# Altium project GECKO3.PRJPCB (part 1 of 4)
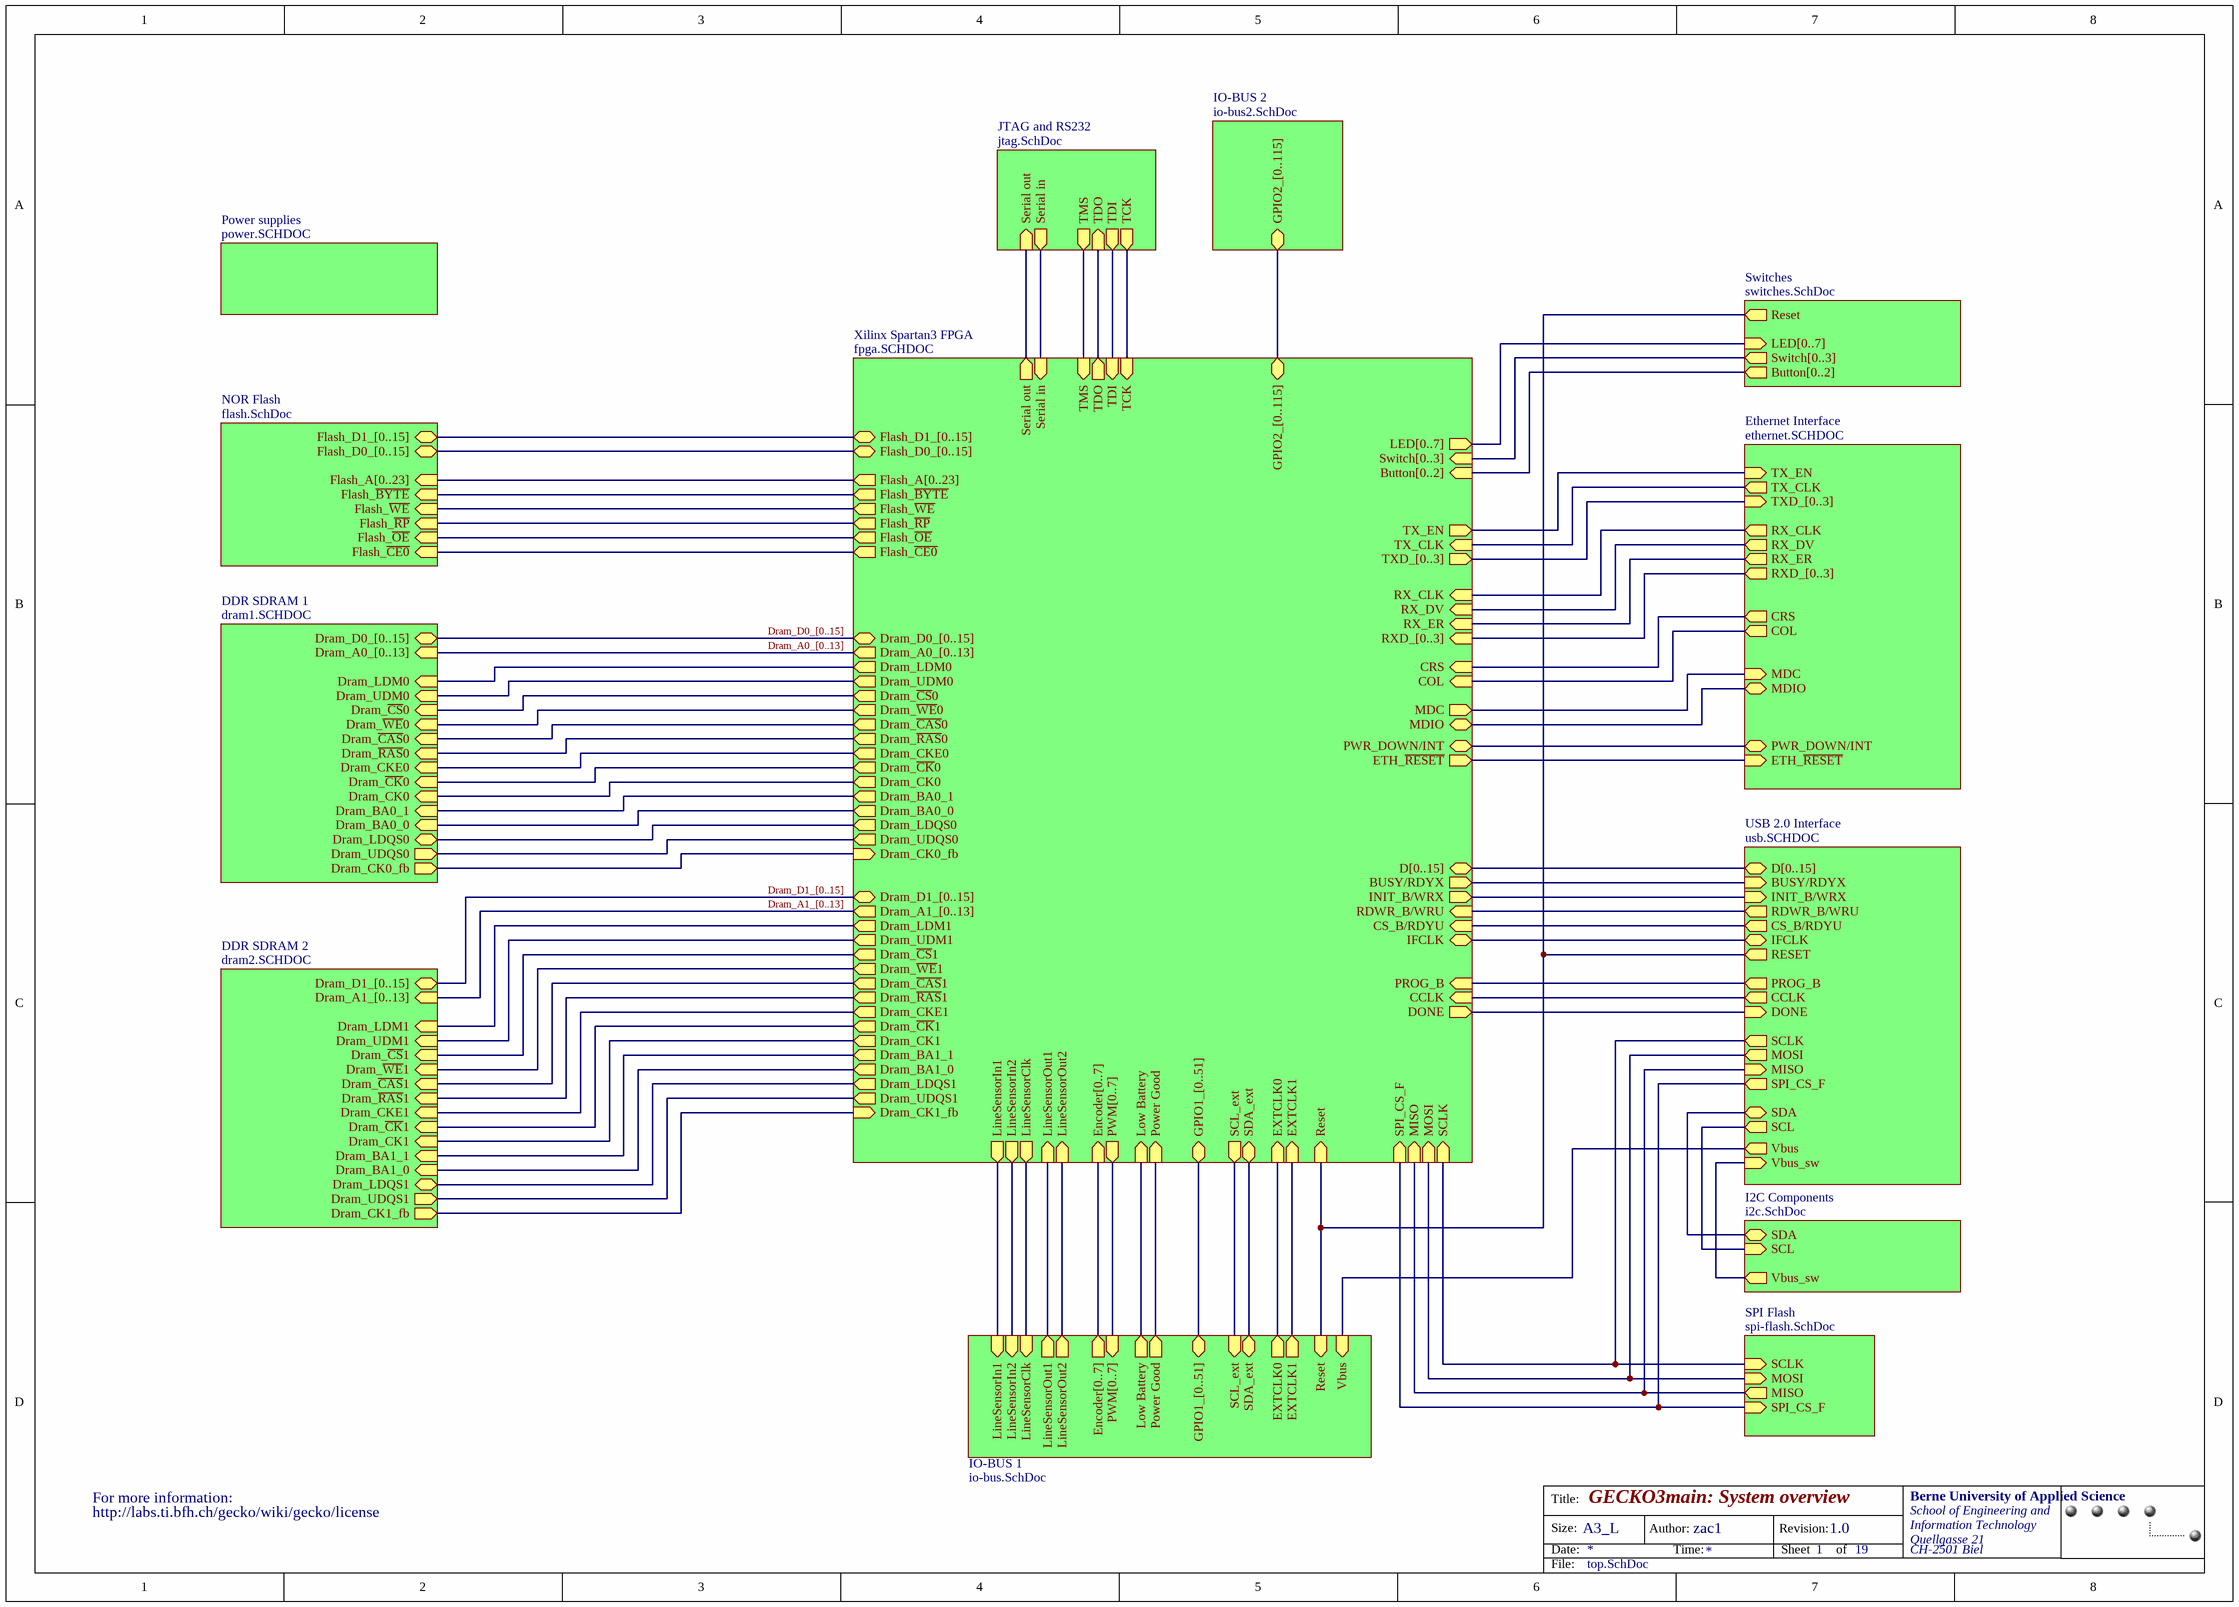
[diagram p0: top.SchDoc]
.SHEETTOTAL: 19; .TITLE: Gecko3
17 sheets, 291 parts. Net scope: global (net labels, ports and power ports of the same name join across sheets).
Board files: gecko3.PcbDoc, gecko3_Panel.pcbdoc, amp.PcbDoc, gecko3_stencil.PCBDOC
Sheets:
  top.SchDoc
    Power supplies = power.SCHDOC
    Xilinx Spartan3 FPGA = fpga.SCHDOC
      fpga-config = fpga-config.SCHDOC
      U_fpga1 = fpga1.SchDoc
      U_fpga2 = fpga2.SCHDOC
    SPI Flash = spi-flash.SchDoc
    Ethernet Interface = ethernet.SCHDOC
    JTAG and RS232 = jtag.SchDoc
    I2C Components = i2c.SchDoc
    IO-BUS 1 = io-bus.SchDoc
    IO-BUS 2 = io-bus2.SchDoc
    Switches = switches.SchDoc
    USB 2.0 Interface = usb.SCHDOC
    NOR Flash = flash.SchDoc
    DDR SDRAM 1 = dram1.SCHDOC
    DDR SDRAM 2 = dram2.SCHDOC

## Sheet top.SchDoc: GECKO3main: System overview
size A3; Organization: Berne University of Applied Science; Address1: School of Engineering and; Address2: Information Technology; Address3: Quellgasse 21; Address4: CH-2501 Biel; Revision: 1.0; SheetNumber: 1; SheetTotal: 19; ApprovedBy: zem1; Author: zac1

### Parts
1  (no value)  [CC-License]

### Sub-sheets
DDR SDRAM 1 = dram1.SCHDOC: Dram_D0_[0..15] (bidir), Dram_A0_[0..13] (in), Dram_LDM0 (in), Dram_UDM0 (in), Dram_~{CS}0 (in), Dram_~{WE}0 (in), Dram_~{CAS}0 (in), Dram_~{RAS}0 (in), Dram_CKE0 (in), Dram_~{CK}0 (in), Dram_CK0 (in), Dram_BA0_1 (in), Dram_BA0_0 (in), Dram_LDQS0 (bidir), Dram_UDQS0 (out), Dram_CK0_fb (out)
DDR SDRAM 2 = dram2.SCHDOC: Dram_D1_[0..15] (bidir), Dram_A1_[0..13] (in), Dram_LDM1 (in), Dram_UDM1 (in), Dram_~{CS}1 (in), Dram_~{WE}1 (in), Dram_~{CAS}1 (in), Dram_~{RAS}1 (in), Dram_CKE1 (in), Dram_~{CK}1 (in), Dram_CK1 (in), Dram_BA1_1 (in), Dram_BA1_0 (in), Dram_LDQS1 (bidir), Dram_UDQS1 (out), Dram_CK1_fb (out)
Ethernet Interface = ethernet.SCHDOC: PWR_DOWN/INT (bidir), ETH_~{RESET} (in), TX_CLK (out), RXD_[0..3] (out), RX_CLK (out), RX_DV (out), RX_ER (out), CRS (out), COL (out), TX_EN (in), TXD_[0..3] (in), MDC (in), MDIO (bidir)
I2C Components = i2c.SchDoc: SDA (bidir), SCL (in), Vbus_sw (out)
IO-BUS 1 = io-bus.SchDoc: Vbus (in), PWM[0..7] (in), GPIO1_[0..51] (bidir), Encoder[0..7] (out), Power Good (out), Low Battery (out), SDA_ext (bidir), Reset (in), SCL_ext (in), EXTCLK0 (out), EXTCLK1 (out), LineSensorOut2 (out), LineSensorOut1 (out), LineSensorIn2 (in), LineSensorClk (in), LineSensorIn1 (in)
IO-BUS 2 = io-bus2.SchDoc: GPIO2_[0..115] (bidir)
JTAG and RS232 = jtag.SchDoc: TCK (out), TDI (out), TMS (out), TDO (in), Serial out (in), Serial in (out)
NOR Flash = flash.SchDoc: Flash_A[0..23] (in), Flash_~{BYTE} (in), Flash_~{WE} (in), Flash_~{RP} (in), Flash_~{OE} (in), Flash_~{CE0} (in), Flash_D0_[0..15] (bidir), Flash_D1_[0..15] (bidir)
Power supplies = power.SCHDOC: no entries
SPI Flash = spi-flash.SchDoc: MOSI (in), SPI_CS_F (in), SCLK (in), MISO (out)
Switches = switches.SchDoc: LED[0..7] (in), Button[0..2] (out), Switch[0..3] (out), Reset (out)
USB 2.0 Interface = usb.SCHDOC: D[0..15] (bidir), Vbus (out), DONE (in), INIT_B/WRX (in), PROG_B (out), RDWR_B/WRU (out), BUSY/RDYX (in), RESET (out), CS_B/RDYU (out), CCLK (out), MISO (in), SPI_CS_F (out), MOSI (out), SCLK (out), SDA (bidir), SCL (out), Vbus_sw (in), IFCLK (bidir)
Xilinx Spartan3 FPGA = fpga.SCHDOC: PWR_DOWN/INT (bidir), ETH_~{RESET} (out), Flash_D1_[0..15] (bidir), Power Good (in), Low Battery (in), Flash_D0_[0..15] (bidir), Flash_~{BYTE} (out), Flash_~{WE} (out), Flash_~{RP} (out), Flash_~{OE} (out), Flash_~{CE0} (out), SDA_ext (bidir), SCL_ext (out), PWM[0..7] (out), GPIO1_[0..51] (bidir), Encoder[0..7] (in), GPIO2_[0..115] (bidir), Flash_A[0..23] (out), MOSI (in), SCLK (in), MISO (in), SPI_CS_F (in), Dram_D1_[0..15] (bidir), Dram_A1_[0..13] (out), Dram_LDM1 (out), Dram_UDM1 (out), Dram_~{CS}1 (out), Dram_~{WE}1 (out), Dram_~{CAS}1 (out), Dram_~{RAS}1 (out), Dram_CKE1 (out), Dram_~{CK}1 (out), Dram_CK1 (out), Dram_BA1_1 (out), Dram_BA1_0 (out), Dram_LDQS1 (out), Dram_UDQS1 (out), LED[0..7] (out), Button[0..2] (in), Switch[0..3] (in), TX_CLK (in), RXD_[0..3] (in), RX_CLK (in), RX_DV (in), RX_ER (in), CRS (in), COL (in), TX_EN (out), TXD_[0..3] (out), MDC (out), MDIO (bidir), D[0..15] (bidir), DONE (out), INIT_B/WRX (out), PROG_B (in), RDWR_B/WRU (in), BUSY/RDYX (out), CS_B/RDYU (in), CCLK (in), Dram_D0_[0..15] (bidir), Dram_A0_[0..13] (out), Dram_LDM0 (out), Dram_UDM0 (out), Dram_~{CS}0 (out), Dram_~{WE}0 (out), Dram_~{CAS}0 (out), Dram_~{RAS}0 (out), Dram_CKE0 (out), Dram_~{CK}0 (out), Dram_CK0 (out), Dram_BA0_1 (out), Dram_BA0_0 (out), Dram_LDQS0 (out), Dram_UDQS0 (out), EXTCLK0 (in), EXTCLK1 (in), TCK (in), TDI (in), TMS (in), TDO (out), Serial out (out), Serial in (in), Reset (in), IFCLK (bidir), Dram_CK1_fb (in), Dram_CK0_fb (in), LineSensorOut2 (in), LineSensorOut1 (in), LineSensorIn2 (out), LineSensorClk (out), LineSensorIn1 (out)

### Nets
(unnamed): sheet Xilinx Spartan3 FPGA/PWR_DOWN/INT, sheet Ethernet Interface/PWR_DOWN/INT
(unnamed): sheet Xilinx Spartan3 FPGA/ETH_~{RESET}, sheet Ethernet Interface/ETH_~{RESET}
(unnamed): sheet Xilinx Spartan3 FPGA/Power Good, sheet IO-BUS 1/Power Good
(unnamed): sheet Xilinx Spartan3 FPGA/Low Battery, sheet IO-BUS 1/Low Battery
(unnamed): sheet Xilinx Spartan3 FPGA/Flash_~{BYTE}, sheet NOR Flash/Flash_~{BYTE}
(unnamed): sheet Xilinx Spartan3 FPGA/Flash_~{WE}, sheet NOR Flash/Flash_~{WE}
(unnamed): sheet Xilinx Spartan3 FPGA/Flash_~{RP}, sheet NOR Flash/Flash_~{RP}
(unnamed): sheet Xilinx Spartan3 FPGA/Flash_~{OE}, sheet NOR Flash/Flash_~{OE}
(unnamed): sheet Xilinx Spartan3 FPGA/Flash_~{CE0}, sheet NOR Flash/Flash_~{CE0}
(unnamed): sheet Xilinx Spartan3 FPGA/SDA_ext, sheet IO-BUS 1/SDA_ext
(unnamed): sheet Xilinx Spartan3 FPGA/SCL_ext, sheet IO-BUS 1/SCL_ext
(unnamed): sheet Xilinx Spartan3 FPGA/MOSI, sheet SPI Flash/MOSI, sheet USB 2.0 Interface/MOSI
(unnamed): sheet Xilinx Spartan3 FPGA/SCLK, sheet SPI Flash/SCLK, sheet USB 2.0 Interface/SCLK
(unnamed): sheet Xilinx Spartan3 FPGA/MISO, sheet SPI Flash/MISO, sheet USB 2.0 Interface/MISO
(unnamed): sheet Xilinx Spartan3 FPGA/SPI_CS_F, sheet SPI Flash/SPI_CS_F, sheet USB 2.0 Interface/SPI_CS_F
(unnamed): sheet Xilinx Spartan3 FPGA/Dram_LDM1, sheet DDR SDRAM 2/Dram_LDM1
(unnamed): sheet Xilinx Spartan3 FPGA/Dram_UDM1, sheet DDR SDRAM 2/Dram_UDM1
(unnamed): sheet Xilinx Spartan3 FPGA/Dram_~{CS}1, sheet DDR SDRAM 2/Dram_~{CS}1
(unnamed): sheet Xilinx Spartan3 FPGA/Dram_~{WE}1, sheet DDR SDRAM 2/Dram_~{WE}1
(unnamed): sheet Xilinx Spartan3 FPGA/Dram_~{CAS}1, sheet DDR SDRAM 2/Dram_~{CAS}1
(unnamed): sheet Xilinx Spartan3 FPGA/Dram_~{RAS}1, sheet DDR SDRAM 2/Dram_~{RAS}1
(unnamed): sheet Xilinx Spartan3 FPGA/Dram_CKE1, sheet DDR SDRAM 2/Dram_CKE1
(unnamed): sheet Xilinx Spartan3 FPGA/Dram_~{CK}1, sheet DDR SDRAM 2/Dram_~{CK}1
(unnamed): sheet Xilinx Spartan3 FPGA/Dram_CK1, sheet DDR SDRAM 2/Dram_CK1
(unnamed): sheet Xilinx Spartan3 FPGA/Dram_BA1_1, sheet DDR SDRAM 2/Dram_BA1_1
(unnamed): sheet Xilinx Spartan3 FPGA/Dram_BA1_0, sheet DDR SDRAM 2/Dram_BA1_0
(unnamed): sheet Xilinx Spartan3 FPGA/Dram_LDQS1, sheet DDR SDRAM 2/Dram_LDQS1
(unnamed): sheet Xilinx Spartan3 FPGA/Dram_UDQS1, sheet DDR SDRAM 2/Dram_UDQS1
(unnamed): sheet Xilinx Spartan3 FPGA/TX_CLK, sheet Ethernet Interface/TX_CLK
(unnamed): sheet Xilinx Spartan3 FPGA/RX_CLK, sheet Ethernet Interface/RX_CLK
(unnamed): sheet Xilinx Spartan3 FPGA/RX_DV, sheet Ethernet Interface/RX_DV
(unnamed): sheet Xilinx Spartan3 FPGA/RX_ER, sheet Ethernet Interface/RX_ER
(unnamed): sheet Xilinx Spartan3 FPGA/CRS, sheet Ethernet Interface/CRS
(unnamed): sheet Xilinx Spartan3 FPGA/COL, sheet Ethernet Interface/COL
(unnamed): sheet Xilinx Spartan3 FPGA/TX_EN, sheet Ethernet Interface/TX_EN
(unnamed): sheet Xilinx Spartan3 FPGA/MDC, sheet Ethernet Interface/MDC
(unnamed): sheet Xilinx Spartan3 FPGA/MDIO, sheet Ethernet Interface/MDIO
(unnamed): sheet Xilinx Spartan3 FPGA/DONE, sheet USB 2.0 Interface/DONE
(unnamed): sheet Xilinx Spartan3 FPGA/INIT_B/WRX, sheet USB 2.0 Interface/INIT_B/WRX
(unnamed): sheet Xilinx Spartan3 FPGA/PROG_B, sheet USB 2.0 Interface/PROG_B
(unnamed): sheet Xilinx Spartan3 FPGA/RDWR_B/WRU, sheet USB 2.0 Interface/RDWR_B/WRU
(unnamed): sheet Xilinx Spartan3 FPGA/BUSY/RDYX, sheet USB 2.0 Interface/BUSY/RDYX
(unnamed): sheet Xilinx Spartan3 FPGA/CS_B/RDYU, sheet USB 2.0 Interface/CS_B/RDYU
(unnamed): sheet Xilinx Spartan3 FPGA/CCLK, sheet USB 2.0 Interface/CCLK
(unnamed): sheet Xilinx Spartan3 FPGA/Dram_LDM0, sheet DDR SDRAM 1/Dram_LDM0
(unnamed): sheet Xilinx Spartan3 FPGA/Dram_UDM0, sheet DDR SDRAM 1/Dram_UDM0
(unnamed): sheet Xilinx Spartan3 FPGA/Dram_~{CS}0, sheet DDR SDRAM 1/Dram_~{CS}0
(unnamed): sheet Xilinx Spartan3 FPGA/Dram_~{WE}0, sheet DDR SDRAM 1/Dram_~{WE}0
(unnamed): sheet Xilinx Spartan3 FPGA/Dram_~{CAS}0, sheet DDR SDRAM 1/Dram_~{CAS}0
(unnamed): sheet Xilinx Spartan3 FPGA/Dram_~{RAS}0, sheet DDR SDRAM 1/Dram_~{RAS}0
(unnamed): sheet Xilinx Spartan3 FPGA/Dram_CKE0, sheet DDR SDRAM 1/Dram_CKE0
(unnamed): sheet Xilinx Spartan3 FPGA/Dram_~{CK}0, sheet DDR SDRAM 1/Dram_~{CK}0
(unnamed): sheet Xilinx Spartan3 FPGA/Dram_CK0, sheet DDR SDRAM 1/Dram_CK0
(unnamed): sheet Xilinx Spartan3 FPGA/Dram_BA0_1, sheet DDR SDRAM 1/Dram_BA0_1
(unnamed): sheet Xilinx Spartan3 FPGA/Dram_BA0_0, sheet DDR SDRAM 1/Dram_BA0_0
(unnamed): sheet Xilinx Spartan3 FPGA/Dram_LDQS0, sheet DDR SDRAM 1/Dram_LDQS0
(unnamed): sheet Xilinx Spartan3 FPGA/Dram_UDQS0, sheet DDR SDRAM 1/Dram_UDQS0
(unnamed): sheet Xilinx Spartan3 FPGA/EXTCLK0, sheet IO-BUS 1/EXTCLK0
(unnamed): sheet Xilinx Spartan3 FPGA/EXTCLK1, sheet IO-BUS 1/EXTCLK1
(unnamed): sheet Xilinx Spartan3 FPGA/TCK, sheet JTAG and RS232/TCK
(unnamed): sheet Xilinx Spartan3 FPGA/TDI, sheet JTAG and RS232/TDI
(unnamed): sheet Xilinx Spartan3 FPGA/TMS, sheet JTAG and RS232/TMS
(unnamed): sheet Xilinx Spartan3 FPGA/TDO, sheet JTAG and RS232/TDO
(unnamed): sheet Xilinx Spartan3 FPGA/Serial out, sheet JTAG and RS232/Serial out
(unnamed): sheet Xilinx Spartan3 FPGA/Serial in, sheet JTAG and RS232/Serial in
(unnamed): sheet Xilinx Spartan3 FPGA/Reset, sheet IO-BUS 1/Reset, sheet Switches/Reset, sheet USB 2.0 Interface/RESET
(unnamed): sheet Xilinx Spartan3 FPGA/IFCLK, sheet USB 2.0 Interface/IFCLK
(unnamed): sheet Xilinx Spartan3 FPGA/Dram_CK1_fb, sheet DDR SDRAM 2/Dram_CK1_fb
(unnamed): sheet Xilinx Spartan3 FPGA/Dram_CK0_fb, sheet DDR SDRAM 1/Dram_CK0_fb
(unnamed): sheet Xilinx Spartan3 FPGA/LineSensorOut2, sheet IO-BUS 1/LineSensorOut2
(unnamed): sheet Xilinx Spartan3 FPGA/LineSensorOut1, sheet IO-BUS 1/LineSensorOut1
(unnamed): sheet Xilinx Spartan3 FPGA/LineSensorIn2, sheet IO-BUS 1/LineSensorIn2
(unnamed): sheet Xilinx Spartan3 FPGA/LineSensorClk, sheet IO-BUS 1/LineSensorClk
(unnamed): sheet Xilinx Spartan3 FPGA/LineSensorIn1, sheet IO-BUS 1/LineSensorIn1
(unnamed): sheet I2C Components/SDA, sheet USB 2.0 Interface/SDA
(unnamed): sheet I2C Components/SCL, sheet USB 2.0 Interface/SCL
(unnamed): sheet I2C Components/Vbus_sw, sheet USB 2.0 Interface/Vbus_sw
(unnamed): sheet IO-BUS 1/Vbus, sheet USB 2.0 Interface/Vbus

### Buses and harness runs
bus Dram_A0_[0..13] = sheet DDR SDRAM 1/Dram_A0_[0..13] = sheet Xilinx Spartan3 FPGA/Dram_A0_[0..13]
bus Dram_A1_[0..13] = sheet DDR SDRAM 2/Dram_A1_[0..13] = sheet Xilinx Spartan3 FPGA/Dram_A1_[0..13]
bus Dram_D0_[0..15] = sheet DDR SDRAM 1/Dram_D0_[0..15] = sheet Xilinx Spartan3 FPGA/Dram_D0_[0..15]
bus Dram_D1_[0..15] = sheet DDR SDRAM 2/Dram_D1_[0..15] = sheet Xilinx Spartan3 FPGA/Dram_D1_[0..15]
bus sheet Ethernet Interface/RXD_[0..3] = sheet Xilinx Spartan3 FPGA/RXD_[0..3]
bus sheet Ethernet Interface/TXD_[0..3] = sheet Xilinx Spartan3 FPGA/TXD_[0..3]
bus sheet IO-BUS 1/Encoder[0..7] = sheet Xilinx Spartan3 FPGA/Encoder[0..7]
bus sheet IO-BUS 1/GPIO1_[0..51] = sheet Xilinx Spartan3 FPGA/GPIO1_[0..51]
bus sheet IO-BUS 1/PWM[0..7] = sheet Xilinx Spartan3 FPGA/PWM[0..7]
bus sheet IO-BUS 2/GPIO2_[0..115] = sheet Xilinx Spartan3 FPGA/GPIO2_[0..115]
bus sheet NOR Flash/Flash_A[0..23] = sheet Xilinx Spartan3 FPGA/Flash_A[0..23]
bus sheet NOR Flash/Flash_D0_[0..15] = sheet Xilinx Spartan3 FPGA/Flash_D0_[0..15]
bus sheet NOR Flash/Flash_D1_[0..15] = sheet Xilinx Spartan3 FPGA/Flash_D1_[0..15]
bus sheet Switches/Button[0..2] = sheet Xilinx Spartan3 FPGA/Button[0..2]
bus sheet Switches/LED[0..7] = sheet Xilinx Spartan3 FPGA/LED[0..7]
bus sheet Switches/Switch[0..3] = sheet Xilinx Spartan3 FPGA/Switch[0..3]
bus sheet USB 2.0 Interface/D[0..15] = sheet Xilinx Spartan3 FPGA/D[0..15]

### Notes on the sheet
- (near 1) http://labs.ti.bfh.ch/gecko/wiki/gecko/license
- (near 1) For more information:
- Title:
- Size:
- Date:
- A3_L
- Author:
- Time:
- Revision:
- Sheet
- of
- File:

### Library data of the parts
1 = CC License

## Sheet power.SCHDOC: Power Suplies
size A4; Organization: Berne University of Applied Science; Address1: School of Engineering and; Address2: Information Technology; Address3: Quellgasse 21; Address4: CH-2501 Biel; Revision: 1.0; SheetNumber: 6; SheetTotal: 19; ApprovedBy: zem1; Author: zac1
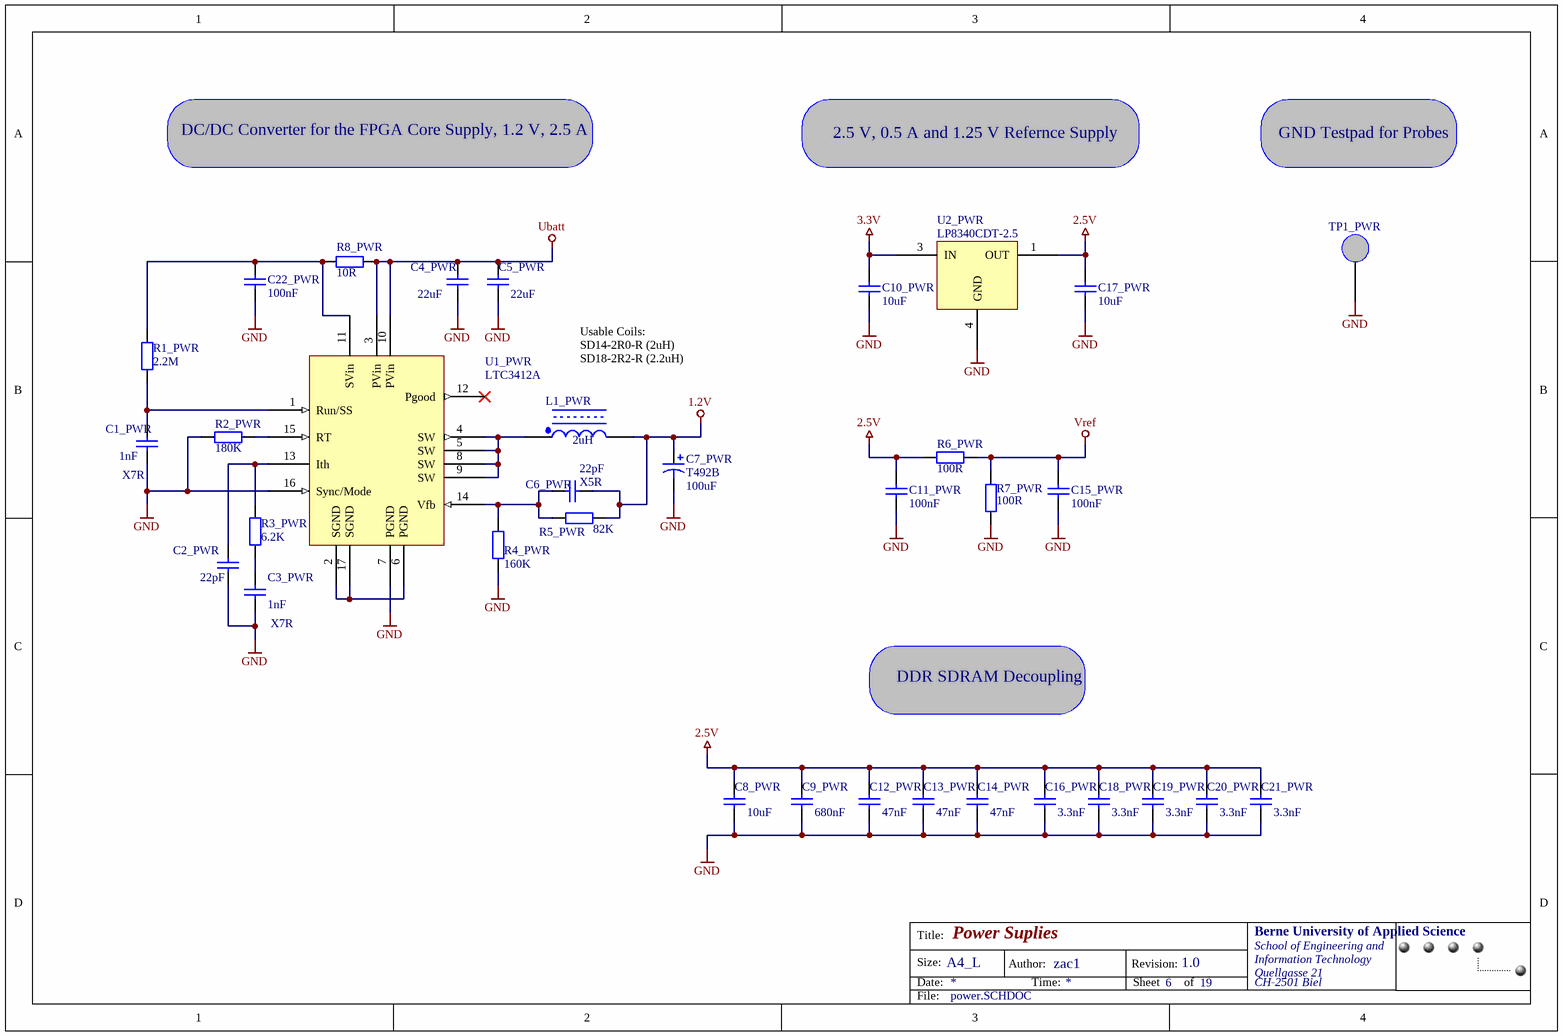
[diagram p1: power.SCHDOC]

### Parts
C1_PWR  value 1nF  Spec: X7R  [0402]  (hidden comment: Cap)
C2_PWR  value 22pF  [0402]  (hidden comment: Cap)
C3_PWR  value 1nF  Spec: X7R  [0402]  (hidden comment: Cap)
C4_PWR  value 22uF  [CC3225-1210]  (hidden comment: Cap)
C5_PWR  value 22uF  [1210]  (hidden comment: Cap)
C6_PWR  value 22pF  Spec: X5R  [0402]  (hidden comment: Cap)
C7_PWR  T492B  value 100uF  [B]
C8_PWR  value 10uF  [1206]  (hidden comment: Cap)
C9_PWR  value 680nF  [0805]  (hidden comment: Cap)
C10_PWR  value 10uF  [1206]  (hidden comment: Cap)
C11_PWR  value 100nF  [0402]  (hidden comment: Cap)
C12_PWR  value 47nF  [0402]  (hidden comment: Cap)
C13_PWR  value 47nF  [0402]  (hidden comment: Cap)
C14_PWR  value 47nF  [0402]  (hidden comment: Cap)
C15_PWR  value 100nF  [0402]  (hidden comment: Cap)
C16_PWR  value 3.3nF  [0402]  (hidden comment: Cap)
C17_PWR  value 10uF  [1206]  (hidden comment: Cap)
C18_PWR  value 3.3nF  [0402]  (hidden comment: Cap)
C19_PWR  value 3.3nF  [0402]  (hidden comment: Cap)
C20_PWR  value 3.3nF  [0402]  (hidden comment: Cap)
C21_PWR  value 3.3nF  [0402]  (hidden comment: Cap)
C22_PWR  value 100nF  [0402]  (hidden comment: Cap)
L1_PWR  2uH  [coil-sd-serie]
R1_PWR  value 2.2M  [0402]  (hidden comment: Res2)
R2_PWR  value 180K  [0402]  (hidden comment: Res2)
R3_PWR  value 6.2K  [0603]  (hidden comment: Res2)
R4_PWR  value 160K  [0603]  (hidden comment: Res2)
R5_PWR  value 82K  [0402]  (hidden comment: Res2)
R6_PWR  value 100R  [0402]  (hidden comment: Res2)
R7_PWR  value 100R  [0402]  (hidden comment: Res2)
R8_PWR  value 10R  [0402]  (hidden comment: Res2)
TP1_PWR  TESTPAD-SMD  [TESTPAD-SMD]  (value not drawn)
U1_PWR  LTC3412A  [QFN16]
U2_PWR  value LP8340CDT-2.5  [TO-252]  (hidden comment: LP8340CDT)

### Nets
1.2V: C6_PWR.1 C7_PWR.1 L1_PWR.2 R5_PWR.1
2.5V: C8_PWR.1 C9_PWR.1 C11_PWR.2 C12_PWR.1 C13_PWR.1 C14_PWR.1 C16_PWR.1 C17_PWR.2 C18_PWR.1 C19_PWR.1 C20_PWR.1 C21_PWR.1 R6_PWR.2 U2_PWR.1(OUT)
3.3V: C10_PWR.2 U2_PWR.3(IN)
GND: C1_PWR.1 C2_PWR.1 C3_PWR.1 C4_PWR.1 C5_PWR.1 C7_PWR.2 C8_PWR.2 C9_PWR.2 C10_PWR.1 C11_PWR.1 C12_PWR.2 C13_PWR.2 C14_PWR.2 C15_PWR.1 C16_PWR.2 C17_PWR.1 C18_PWR.2 C19_PWR.2 C20_PWR.2 C21_PWR.2 C22_PWR.2 R2_PWR.2 R4_PWR.1 R7_PWR.1 TP1_PWR.1 U1_PWR.7(PGND) U1_PWR.16(Sync/Mode) U2_PWR.4(GND)
Ubatt: C4_PWR.2 C5_PWR.2 R8_PWR.1 U1_PWR.3(PVin) U1_PWR.10(PVin)
Vref: C15_PWR.2 R6_PWR.1 R7_PWR.2
NetC1_PWR_2: C1_PWR.2 R1_PWR.1 U1_PWR.1(Run/SS)
NetC2_PWR_2: C2_PWR.2 R3_PWR.1 U1_PWR.13(Ith)
NetC3_PWR_2: C3_PWR.2 R3_PWR.2
NetC6_PWR_2: C6_PWR.2 R4_PWR.2 R5_PWR.2 U1_PWR.14(Vfb)
NetC22_PWR_1: C22_PWR.1 R1_PWR.2 R8_PWR.2 U1_PWR.11(SVin)
NetL1_PWR_1: L1_PWR.1 U1_PWR.4(SW) U1_PWR.5(SW) U1_PWR.8(SW) U1_PWR.9(SW)
NetR2_PWR_1: R2_PWR.1 U1_PWR.15(RT)
NetU1_PWR_2: U1_PWR.2(SGND) U1_PWR.6(PGND) U1_PWR.17(SGND)

Not connected (* = marked no-connect by the designer): U1_PWR 12(Pgood)*

### Notes on the sheet
- DC/DC Converter for the FPGA Core Supply, 1.2 V, 2.5 A
- 2.5 V, 0.5 A and 1.25 V Refernce Supply
- GND Testpad for Probes
- Usable Coils:
  SD14-2R0-R (2uH)
  SD18-2R2-R (2.2uH)
- DDR SDRAM Decoupling
- Title:
- Size:
- Date:
- A4_L
- Author:
- Time:
- Revision:
- Sheet
- of
- File:

### Library data of the parts
C1_PWR C3_PWR = Cap: Capacitor; Manufacturer: PHYCOMP; Part Number: 2238 587 15623; Class I: Passive; Currency: CHF; Packaging unit: 10; Prize: 0.11; Published: 8-Jun-2000; Revision: July-2002: Re-released for DXP Platform.; Publisher: Altium Limited; Class II: Capacitor; Distributor Number: 3019 380; RoHS: yes; Distributor: Farnell
C2_PWR C6_PWR = Cap: Capacitor; Manufacturer: Murata; Part Number: GRM1555C1H220JZ01D; Class I: Passive; Currency: CHF; Packaging unit: 10; Prize: 0.07; Published: 8-Jun-2000; Revision: July-2002: Re-released for DXP Platform.; Publisher: Altium Limited; Class II: Capacitor; Distributor Number: 8819 629; RoHS: yes; Distributor: Farnell
C4_PWR C5_PWR = Cap: Capacitor; Manufacturer: Yuden; Part Number: EMK325BJ226MM-T; Class I: Passive; Currency: CHF; Packaging unit: 1; Prize: 0.67; lead time: 14 Tage; Published: 8-Jun-2000; Revision: July-2002: Re-released for DXP Platform.; Publisher: Altium Limited; Class II: Capacitor; Distributor Number: 6578 950; RoHS: yes; Distributor: Farnell
C7_PWR = T492B: Solid Tantalum Chip Capacitor, T492 Series - CWR11 Style Per Mil-PRF-55365/8; Manufacturer: AVX; Part Number: TCJB107M004R0070; Currency: CHF; Packaging unit: 1; Prize: 0.98; Published: 17-Jul-2002; LatestRevisionDate: 19-Mar-2004; LatestRevisionNote: Silkscreen dimensions re-sized.; DatasheetDocument: Mar-2001; PackageDocument: Mar-2001; PackageReference: B; Publisher: Altium Limited; Code_JEITA: 3528-21; ComponentLink1Description: Manufacturer Link; ComponentLink1URL: http://www.kemet.com/; ComponentLink2Description: Datasheet; ComponentLink2URL: http://www.kemet.com/kemet/web/homepage/kechome.nsf/vapubfilesname/F3102TA.pdf/$file/F3102TA.pdf; Distributor Number: 1135 228; RoHS: yes; Distributor: Farnell
C8_PWR C10_PWR C17_PWR = Cap: Capacitor; Manufacturer: Murata; Part Number: GRM31CR70J106KA01L; Class I: Passive; Currency: CHF; Packaging unit: 1; Prize: 0.25; Published: 8-Jun-2000; Revision: July-2002: Re-released for DXP Platform.; Publisher: Altium Limited; Class II: Capacitor; Distributor Number: 9527 729; RoHS: yes; Distributor: Farnell
C9_PWR = Cap: Capacitor; Manufacturer: PHYCOMP; Part Number: 2238 240 15661; Class I: Passive; Currency: CHF; Packaging unit: 10; Prize: 0.34; Published: 8-Jun-2000; Revision: July-2002: Re-released for DXP Platform.; Publisher: Altium Limited; Class II: Capacitor; Distributor Number: 3352 055; RoHS: yes; Distributor: Farnell
C11_PWR C15_PWR C22_PWR = Cap: Capacitor; Manufacturer: Murata; Part Number: GRM155R71C104KA88D; Class I: Passive; Currency: CHF; Packaging unit: 10; Prize: 0.07; Published: 8-Jun-2000; Revision: July-2002: Re-released for DXP Platform.; Publisher: Altium Limited; Class II: Capacitor; Distributor Number: 8819 742; RoHS: yes; Distributor: Farnell
C12_PWR C13_PWR C14_PWR = Cap: Capacitor; Manufacturer: PHYCOMP; Part Number: 2238 787 19845; Class I: Passive; Currency: CHF; Packaging unit: 10; Prize: 0.15; Published: 8-Jun-2000; Revision: July-2002: Re-released for DXP Platform.; Publisher: Altium Limited; Class II: Capacitor; Distributor Number: 3019 469; RoHS: yes; Distributor: Farnell
C16_PWR C18_PWR C19_PWR C20_PWR C21_PWR = Cap: Capacitor; Manufacturer: PHYCOMP; Part Number: 2238 587 15629; Class I: Passive; Currency: CHF; Packaging unit: 10; Prize: 0.11; Published: 8-Jun-2000; Revision: July-2002: Re-released for DXP Platform.; Publisher: Altium Limited; Class II: Capacitor; Distributor Number: 3019 410; RoHS: yes; Distributor: Farnell
L1_PWR = COIL-SD-SERIE: SD Series Coils from Coiltronics; Manufacturer: Cooper Bussmann; Part Number: SD14-2R0-R; Currency: CHF; lead time: 10 Days; Packaging unit: 3800; Prize: 1.85; Value: 2uH; RoHS: yes; Distributor: Hy-Line
R1_PWR = Res2: Resistor; Manufacturer: PHYCOMP; Part Number: 232270672205; Class I: Passive; Currency: CHF; Packaging unit: 50; Prize: 0.12; Published: 8-Jun-2000; Revision: July-2002: Re-released for DXP Platform.; Publisher: Altium Limited; Class II: Resistor; Distributor Number: 9239618; RoHS: yes; Distributor: Farnell
R2_PWR = Res2: Resistor; Manufacturer: PHYCOMP; Part Number: 232270671804; Class I: Passive; Currency: CHF; Packaging unit: 50; Prize: 0.12; Published: 8-Jun-2000; Revision: July-2002: Re-released for DXP Platform.; Publisher: Altium Limited; Class II: Resistor; Distributor Number: 9239502; RoHS: yes; Distributor: Farnell
R3_PWR = Res2: Resistor; Manufacturer: Multicomp; Part Number: MC 0.063W 0603 1% 6K2; Class I: Passive; Currency: CHF; Packaging unit: 50; Prize: 0.055; Published: 8-Jun-2000; Revision: July-2002: Re-released for DXP Platform.; Publisher: Altium Limited; Class II: Resistor; Distributor Number: 9331409; RoHS: X-yes; Distributor: Farnell
R4_PWR = Res2: Resistor; Manufacturer: Multicomp; Part Number: MC 0.063W 0603 1% 160K; Class I: Passive; Currency: CHF; Packaging unit: 50; Prize: 0.055; Published: 8-Jun-2000; Revision: July-2002: Re-released for DXP Platform.; Publisher: Altium Limited; Class II: Resistor; Distributor Number: 9330682; RoHS: X-yes; Distributor: Farnell
R5_PWR = Res2: Resistor; Manufacturer: PHYCOMP; Part Number: 232270678203; Class I: Passive; Currency: CHF; Packaging unit: 50; Prize: 0.12; Published: 8-Jun-2000; Revision: July-2002: Re-released for DXP Platform.; Publisher: Altium Limited; Class II: Resistor; Distributor Number: 9239464; RoHS: yes; Distributor: Farnell
R6_PWR R7_PWR = Res2: Resistor; Manufacturer: PHYCOMP; Part Number: 232270671001; Class I: Passive; Currency: CHF; Packaging unit: 50; Prize: 0.12; Published: 8-Jun-2000; Revision: July-2002: Re-released for DXP Platform.; Publisher: Altium Limited; Class II: Resistor; Distributor Number: 9239111; RoHS: yes; Distributor: Farnell
R8_PWR = Res2: Resistor; Manufacturer: TYCO ELECTRONICS; Part Number: CRG0402J10R-10; Class I: Passive; Currency: CHF; Packaging unit: 50; Prize: 0.09; Published: 8-Jun-2000; Revision: July-2002: Re-released for DXP Platform.; Publisher: Altium Limited; Class II: Resistor; Distributor Number: 1174141; RoHS: yes; Distributor: Farnell
TP1_PWR = TESTPAD-SMD: Harwin SMD Testpad; Value: S1751-46R; Currency: CHF; Packaging unit: 100; Prize: 0.1895; Distributor Number: 1022 338; Manufacturer: HARWIN; Part Number: S1751-46R; RoHS: yes; Distributor: Farnell
U1_PWR = LTC3412A: 3 A, 4 MHz, Step-Down Regulator; Manufacturer: Linear; Part Number: LTC3412AEUF#PBF; Currency: $; Packaging unit: 1; Prize: 4.93; lead time: 2 Weeks; Value: LTC3412A; Distributor Number: LTC3412AEUF#PBF; RoHS: yes; Distributor: Linear online
U2_PWR = LP8340CDT: Low Dropout, Low IQ, 1.0A CMOS Linear Regulator; Manufacturer: National; Currency: CHF; Packaging unit: 75; Prize: 1.065; lead time: 6 Weeks; Part Number: LP8340CDT-2.5; RoHS: yes; Distributor: EBV; Distributor Number: LP8340CDT-2.5/NOPB

## Sheet fpga.SCHDOC: FPGA Parts
size A3; Organization: Berne University of Applied Science; Address1: School of Engineering and; Address2: Information Technology; Address3: Quellgasse 21; Address4: CH-2501 Biel; Revision: 1.0; SheetNumber: 2; SheetTotal: 19; ApprovedBy: zem1; Author: zac1
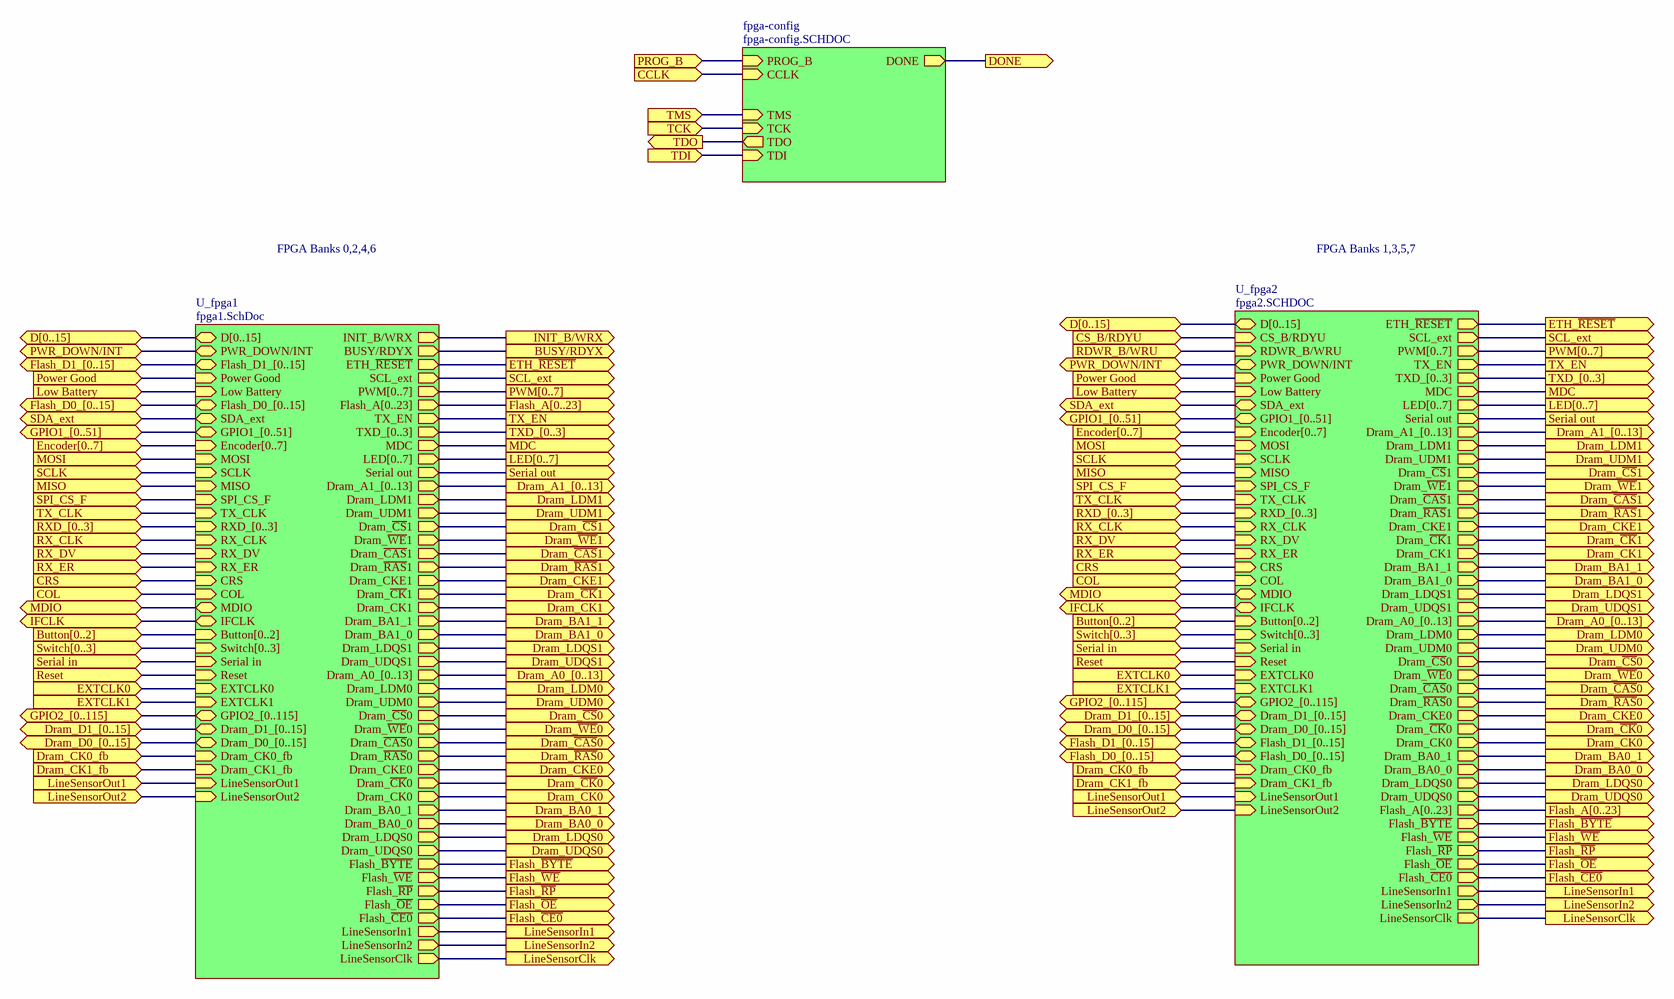
[diagram p2: fpga.SCHDOC]

### Sub-sheets
fpga-config = fpga-config.SCHDOC: DONE (out), PROG_B (in), CCLK (in), TCK (in), TDI (in), TMS (in), TDO (out)
U_fpga1 = fpga1.SchDoc: D[0..15] (bidir), INIT_B/WRX (out), BUSY/RDYX (out), PWR_DOWN/INT (bidir), ETH_~{RESET} (out), Flash_D1_[0..15] (bidir), Power Good (in), Low Battery (in), Flash_D0_[0..15] (bidir), SDA_ext (bidir), SCL_ext (out), PWM[0..7] (out), GPIO1_[0..51] (bidir), Encoder[0..7] (in), Flash_A[0..23] (out), MOSI (in), SCLK (in), MISO (in), SPI_CS_F (in), TX_CLK (in), RXD_[0..3] (in), RX_CLK (in), RX_DV (in), RX_ER (in), CRS (in), COL (in), TX_EN (out), TXD_[0..3] (out), MDC (out), MDIO (bidir), IFCLK (bidir), LED[0..7] (out), Button[0..2] (in), Switch[0..3] (in), Serial out (out), Serial in (in), Reset (in), EXTCLK0 (in), EXTCLK1 (in), GPIO2_[0..115] (bidir), Dram_D1_[0..15] (bidir), Dram_A1_[0..13] (out), Dram_LDM1 (out), Dram_UDM1 (out), Dram_~{CS}1 (out), Dram_~{WE}1 (out), Dram_~{CAS}1 (out), Dram_~{RAS}1 (out), Dram_CKE1 (out), Dram_~{CK}1 (out), Dram_CK1 (out), Dram_BA1_1 (out), Dram_BA1_0 (out), Dram_LDQS1 (out), Dram_UDQS1 (out), Dram_D0_[0..15] (bidir), Dram_A0_[0..13] (out), Dram_LDM0 (out), Dram_UDM0 (out), Dram_~{CS}0 (out), Dram_~{WE}0 (out), Dram_~{CAS}0 (out), Dram_~{RAS}0 (out), Dram_CKE0 (out), Dram_~{CK}0 (out), Dram_CK0 (out), Dram_BA0_1 (out), Dram_BA0_0 (out), Dram_LDQS0 (out), Dram_UDQS0 (out), Flash_~{BYTE} (out), Flash_~{WE} (out), Flash_~{RP} (out), Flash_~{OE} (out), Flash_~{CE0} (out), Dram_CK0_fb (in), Dram_CK1_fb (in), LineSensorOut2 (in), LineSensorOut1 (in), LineSensorIn1 (out), LineSensorIn2 (out), LineSensorClk (out)
U_fpga2 = fpga2.SCHDOC: D[0..15] (bidir), CS_B/RDYU (in), RDWR_B/WRU (in), PWR_DOWN/INT (bidir), ETH_~{RESET} (out), Power Good (in), Low Battery (in), SDA_ext (bidir), SCL_ext (out), PWM[0..7] (out), GPIO1_[0..51] (bidir), Encoder[0..7] (in), MOSI (in), SCLK (in), MISO (in), SPI_CS_F (in), TX_CLK (in), RXD_[0..3] (in), RX_CLK (in), RX_DV (in), RX_ER (in), CRS (in), COL (in), TX_EN (out), TXD_[0..3] (out), MDC (out), MDIO (bidir), IFCLK (bidir), LED[0..7] (out), Button[0..2] (in), Switch[0..3] (in), Serial out (out), Serial in (in), Reset (in), EXTCLK0 (in), EXTCLK1 (in), GPIO2_[0..115] (bidir), Dram_D1_[0..15] (bidir), Dram_A1_[0..13] (out), Dram_LDM1 (out), Dram_UDM1 (out), Dram_~{CS}1 (out), Dram_~{WE}1 (out), Dram_~{CAS}1 (out), Dram_~{RAS}1 (out), Dram_CKE1 (out), Dram_~{CK}1 (out), Dram_CK1 (out), Dram_BA1_1 (out), Dram_BA1_0 (out), Dram_LDQS1 (out), Dram_UDQS1 (out), Dram_D0_[0..15] (bidir), Dram_A0_[0..13] (out), Dram_LDM0 (out), Dram_UDM0 (out), Dram_~{CS}0 (out), Dram_~{WE}0 (out), Dram_~{CAS}0 (out), Dram_~{RAS}0 (out), Dram_CKE0 (out), Dram_~{CK}0 (out), Dram_CK0 (out), Dram_BA0_1 (out), Dram_BA0_0 (out), Dram_LDQS0 (out), Dram_UDQS0 (out), Flash_D1_[0..15] (bidir), Flash_D0_[0..15] (bidir), Flash_A[0..23] (out), Flash_~{BYTE} (out), Flash_~{WE} (out), Flash_~{RP} (out), Flash_~{OE} (out), Flash_~{CE0} (out), Dram_CK0_fb (in), Dram_CK1_fb (in), LineSensorIn1 (out), LineSensorIn2 (out), LineSensorClk (out), LineSensorOut2 (in), LineSensorOut1 (in)

### Ports
BUSY/RDYX (out), Button[0..2] (in), CCLK (in), COL (in), CRS (in), CS_B/RDYU (in), D[0..15] (bidir), DONE (out), Dram_A0_[0..13] (out), Dram_A1_[0..13] (out), Dram_BA0_0 (out), Dram_BA0_1 (out), Dram_BA1_0 (out), Dram_BA1_1 (out), Dram_CK0 (out), Dram_CK0_fb (in), Dram_CK1 (out), Dram_CK1_fb (in), Dram_CKE0 (out), Dram_CKE1 (out), Dram_D0_[0..15] (bidir), Dram_D1_[0..15] (bidir), Dram_LDM0 (out), Dram_LDM1 (out), Dram_LDQS0 (out), Dram_LDQS1 (out), Dram_UDM0 (out), Dram_UDM1 (out), Dram_UDQS0 (out), Dram_UDQS1 (out), Dram_~{CAS}0 (out), Dram_~{CAS}1 (out), Dram_~{CK}0 (out), Dram_~{CK}1 (out), Dram_~{CS}0 (out), Dram_~{CS}1 (out), Dram_~{RAS}0 (out), Dram_~{RAS}1 (out), Dram_~{WE}0 (out), Dram_~{WE}1 (out), Encoder[0..7] (in), ETH_~{RESET} (out), EXTCLK0 (in), EXTCLK1 (in), Flash_A[0..23] (out), Flash_D0_[0..15] (bidir), Flash_D1_[0..15] (bidir), Flash_~{BYTE} (out), Flash_~{CE0} (out), Flash_~{OE} (out), Flash_~{RP} (out), Flash_~{WE} (out), GPIO1_[0..51] (bidir), GPIO2_[0..115] (bidir), IFCLK (bidir), INIT_B/WRX (out), LED[0..7] (out), LineSensorClk (out), LineSensorIn1 (out), LineSensorIn2 (out), LineSensorOut1 (in), LineSensorOut2 (in), Low Battery (in), MDC (out), MDIO (bidir), MISO (in), MOSI (in), Power Good (in), PROG_B (in), PWM[0..7] (out), PWR_DOWN/INT (bidir), RDWR_B/WRU (in), Reset (in), RX_CLK (in), RX_DV (in), RX_ER (in), RXD_[0..3] (in), SCL_ext (out), SCLK (in), SDA_ext (bidir), Serial in (in), Serial out (out), SPI_CS_F (in), Switch[0..3] (in), TCK (in), TDI (in), TDO (out), TMS (in), TX_CLK (in), TX_EN (out), TXD_[0..3] (out)

### Nets
BUSY/RDYX: port BUSY/RDYX, sheet U_fpga1/BUSY/RDYX
CCLK: port CCLK, sheet fpga-config/CCLK
COL: port COL, sheet U_fpga1/COL, sheet U_fpga2/COL
CRS: port CRS, sheet U_fpga1/CRS, sheet U_fpga2/CRS
CS_B/RDYU: port CS_B/RDYU, sheet U_fpga2/CS_B/RDYU
DONE: port DONE, sheet fpga-config/DONE
DRAM_BA0_0: port Dram_BA0_0, sheet U_fpga1/Dram_BA0_0, sheet U_fpga2/Dram_BA0_0
DRAM_BA0_1: port Dram_BA0_1, sheet U_fpga1/Dram_BA0_1, sheet U_fpga2/Dram_BA0_1
Dram_BA1_0: port Dram_BA1_0, sheet U_fpga1/Dram_BA1_0, sheet U_fpga2/Dram_BA1_0
Dram_BA1_1: port Dram_BA1_1, sheet U_fpga1/Dram_BA1_1, sheet U_fpga2/Dram_BA1_1
DRAM_~{CAS}0: port Dram_~{CAS}0, sheet U_fpga1/Dram_~{CAS}0, sheet U_fpga2/Dram_~{CAS}0
Dram_~{CAS}1: port Dram_~{CAS}1, sheet U_fpga1/Dram_~{CAS}1, sheet U_fpga2/Dram_~{CAS}1
DRAM_~{CK}0: port Dram_~{CK}0, sheet U_fpga1/Dram_~{CK}0, sheet U_fpga2/Dram_~{CK}0
Dram_~{CK}1: port Dram_~{CK}1, sheet U_fpga1/Dram_~{CK}1, sheet U_fpga2/Dram_~{CK}1
DRAM_~{CS}0: port Dram_~{CS}0, sheet U_fpga1/Dram_~{CS}0, sheet U_fpga2/Dram_~{CS}0
Dram_~{CS}1: port Dram_~{CS}1, sheet U_fpga1/Dram_~{CS}1, sheet U_fpga2/Dram_~{CS}1
DRAM_CK0: port Dram_CK0, sheet U_fpga1/Dram_CK0, sheet U_fpga2/Dram_CK0
Dram_CK0_fb: port Dram_CK0_fb, sheet U_fpga1/Dram_CK0_fb, sheet U_fpga2/Dram_CK0_fb
Dram_CK1: port Dram_CK1, sheet U_fpga1/Dram_CK1, sheet U_fpga2/Dram_CK1
DRAM_CK1_FB: port Dram_CK1_fb, sheet U_fpga1/Dram_CK1_fb, sheet U_fpga2/Dram_CK1_fb
DRAM_CKE0: port Dram_CKE0, sheet U_fpga1/Dram_CKE0, sheet U_fpga2/Dram_CKE0
Dram_CKE1: port Dram_CKE1, sheet U_fpga1/Dram_CKE1, sheet U_fpga2/Dram_CKE1
DRAM_LDM0: port Dram_LDM0, sheet U_fpga1/Dram_LDM0, sheet U_fpga2/Dram_LDM0
Dram_LDM1: port Dram_LDM1, sheet U_fpga1/Dram_LDM1, sheet U_fpga2/Dram_LDM1
DRAM_LDQS0: port Dram_LDQS0, sheet U_fpga1/Dram_LDQS0, sheet U_fpga2/Dram_LDQS0
Dram_LDQS1: port Dram_LDQS1, sheet U_fpga1/Dram_LDQS1, sheet U_fpga2/Dram_LDQS1
DRAM_~{RAS}0: port Dram_~{RAS}0, sheet U_fpga1/Dram_~{RAS}0, sheet U_fpga2/Dram_~{RAS}0
Dram_~{RAS}1: port Dram_~{RAS}1, sheet U_fpga1/Dram_~{RAS}1, sheet U_fpga2/Dram_~{RAS}1
DRAM_UDM0: port Dram_UDM0, sheet U_fpga1/Dram_UDM0, sheet U_fpga2/Dram_UDM0
Dram_UDM1: port Dram_UDM1, sheet U_fpga1/Dram_UDM1, sheet U_fpga2/Dram_UDM1
DRAM_UDQS0: port Dram_UDQS0, sheet U_fpga1/Dram_UDQS0, sheet U_fpga2/Dram_UDQS0
Dram_UDQS1: port Dram_UDQS1, sheet U_fpga1/Dram_UDQS1, sheet U_fpga2/Dram_UDQS1
DRAM_~{WE}0: port Dram_~{WE}0, sheet U_fpga1/Dram_~{WE}0, sheet U_fpga2/Dram_~{WE}0
Dram_~{WE}1: port Dram_~{WE}1, sheet U_fpga1/Dram_~{WE}1, sheet U_fpga2/Dram_~{WE}1
ETH_~{RESET}: port ETH_~{RESET}, sheet U_fpga1/ETH_~{RESET}, sheet U_fpga2/ETH_~{RESET}
EXTCLK0: port EXTCLK0, sheet U_fpga1/EXTCLK0, sheet U_fpga2/EXTCLK0
EXTCLK1: port EXTCLK1, sheet U_fpga1/EXTCLK1, sheet U_fpga2/EXTCLK1
FLASH_~{BYTE}: port Flash_~{BYTE}, sheet U_fpga1/Flash_~{BYTE}, sheet U_fpga2/Flash_~{BYTE}
FLASH_~{CE0}: port Flash_~{CE0}, sheet U_fpga1/Flash_~{CE0}, sheet U_fpga2/Flash_~{CE0}
FLASH_~{OE}: port Flash_~{OE}, sheet U_fpga1/Flash_~{OE}, sheet U_fpga2/Flash_~{OE}
FLASH_~{RP}: port Flash_~{RP}, sheet U_fpga1/Flash_~{RP}, sheet U_fpga2/Flash_~{RP}
FLASH_~{WE}: port Flash_~{WE}, sheet U_fpga1/Flash_~{WE}, sheet U_fpga2/Flash_~{WE}
IFCLK: port IFCLK, sheet U_fpga1/IFCLK, sheet U_fpga2/IFCLK
INIT_B/WRX: port INIT_B/WRX, sheet U_fpga1/INIT_B/WRX
LINESENSORCLK: port LineSensorClk, sheet U_fpga1/LineSensorClk, sheet U_fpga2/LineSensorClk
LINESENSORIN1: port LineSensorIn1, sheet U_fpga1/LineSensorIn1, sheet U_fpga2/LineSensorIn1
LINESENSORIN2: port LineSensorIn2, sheet U_fpga1/LineSensorIn2, sheet U_fpga2/LineSensorIn2
LINESENSOROUT1: port LineSensorOut1, sheet U_fpga1/LineSensorOut1, sheet U_fpga2/LineSensorOut1
LINESENSOROUT2: port LineSensorOut2, sheet U_fpga1/LineSensorOut2, sheet U_fpga2/LineSensorOut2
LOW BATTERY: port Low Battery, sheet U_fpga1/Low Battery, sheet U_fpga2/Low Battery
MDC: port MDC, sheet U_fpga1/MDC, sheet U_fpga2/MDC
MDIO: port MDIO, sheet U_fpga1/MDIO, sheet U_fpga2/MDIO
MISO: port MISO, sheet U_fpga1/MISO, sheet U_fpga2/MISO
MOSI: port MOSI, sheet U_fpga1/MOSI, sheet U_fpga2/MOSI
POWER GOOD: port Power Good, sheet U_fpga1/Power Good, sheet U_fpga2/Power Good
PROG_B: port PROG_B, sheet fpga-config/PROG_B
PWR_DOWN/INT: port PWR_DOWN/INT, sheet U_fpga1/PWR_DOWN/INT, sheet U_fpga2/PWR_DOWN/INT
RDWR_B/WRU: port RDWR_B/WRU, sheet U_fpga2/RDWR_B/WRU
RESET: port Reset, sheet U_fpga1/Reset, sheet U_fpga2/Reset
RX_CLK: port RX_CLK, sheet U_fpga1/RX_CLK, sheet U_fpga2/RX_CLK
RX_DV: port RX_DV, sheet U_fpga1/RX_DV, sheet U_fpga2/RX_DV
RX_ER: port RX_ER, sheet U_fpga1/RX_ER, sheet U_fpga2/RX_ER
SCL_EXT: port SCL_ext, sheet U_fpga1/SCL_ext, sheet U_fpga2/SCL_ext
SCLK: port SCLK, sheet U_fpga1/SCLK, sheet U_fpga2/SCLK
SDA_EXT: port SDA_ext, sheet U_fpga1/SDA_ext, sheet U_fpga2/SDA_ext
SERIAL IN: port Serial in, sheet U_fpga1/Serial in, sheet U_fpga2/Serial in
SERIAL OUT: port Serial out, sheet U_fpga1/Serial out, sheet U_fpga2/Serial out
SPI_CS_F: port SPI_CS_F, sheet U_fpga1/SPI_CS_F, sheet U_fpga2/SPI_CS_F
TCK: port TCK, sheet fpga-config/TCK
TDI: port TDI, sheet fpga-config/TDI
TDO: port TDO, sheet fpga-config/TDO
TMS: port TMS, sheet fpga-config/TMS
TX_CLK: port TX_CLK, sheet U_fpga1/TX_CLK, sheet U_fpga2/TX_CLK
TX_EN: port TX_EN, sheet U_fpga1/TX_EN, sheet U_fpga2/TX_EN

### Buses and harness runs
bus port Button[0..2] = sheet U_fpga1/Button[0..2]
bus port Button[0..2] = sheet U_fpga2/Button[0..2]
bus port D[0..15] = sheet U_fpga1/D[0..15]
bus port D[0..15] = sheet U_fpga2/D[0..15]
bus port Dram_A0_[0..13] = sheet U_fpga1/Dram_A0_[0..13]
bus port Dram_A0_[0..13] = sheet U_fpga2/Dram_A0_[0..13]
bus port Dram_A1_[0..13] = sheet U_fpga1/Dram_A1_[0..13]
bus port Dram_A1_[0..13] = sheet U_fpga2/Dram_A1_[0..13]
bus port Dram_D0_[0..15] = sheet U_fpga1/Dram_D0_[0..15]
bus port Dram_D0_[0..15] = sheet U_fpga2/Dram_D0_[0..15]
bus port Dram_D1_[0..15] = sheet U_fpga1/Dram_D1_[0..15]
bus port Dram_D1_[0..15] = sheet U_fpga2/Dram_D1_[0..15]
bus port Encoder[0..7] = sheet U_fpga1/Encoder[0..7]
bus port Encoder[0..7] = sheet U_fpga2/Encoder[0..7]
bus port Flash_A[0..23] = sheet U_fpga1/Flash_A[0..23]
bus port Flash_A[0..23] = sheet U_fpga2/Flash_A[0..23]
bus port Flash_D0_[0..15] = sheet U_fpga1/Flash_D0_[0..15]
bus port Flash_D0_[0..15] = sheet U_fpga2/Flash_D0_[0..15]
bus port Flash_D1_[0..15] = sheet U_fpga1/Flash_D1_[0..15]
bus port Flash_D1_[0..15] = sheet U_fpga2/Flash_D1_[0..15]
bus port GPIO1_[0..51] = sheet U_fpga1/GPIO1_[0..51]
bus port GPIO1_[0..51] = sheet U_fpga2/GPIO1_[0..51]
bus port GPIO2_[0..115] = sheet U_fpga1/GPIO2_[0..115]
bus port GPIO2_[0..115] = sheet U_fpga2/GPIO2_[0..115]
bus port LED[0..7] = sheet U_fpga1/LED[0..7]
bus port LED[0..7] = sheet U_fpga2/LED[0..7]
bus port PWM[0..7] = sheet U_fpga1/PWM[0..7]
bus port PWM[0..7] = sheet U_fpga2/PWM[0..7]
bus port RXD_[0..3] = sheet U_fpga1/RXD_[0..3]
bus port RXD_[0..3] = sheet U_fpga2/RXD_[0..3]
bus port Switch[0..3] = sheet U_fpga1/Switch[0..3]
bus port Switch[0..3] = sheet U_fpga2/Switch[0..3]
bus port TXD_[0..3] = sheet U_fpga1/TXD_[0..3]
bus port TXD_[0..3] = sheet U_fpga2/TXD_[0..3]

### Notes on the sheet
- FPGA Banks 0,2,4,6
- FPGA Banks 1,3,5,7
- Title:
- Size:
- Date:
- A3_L
- Author:
- Time:
- Revision:
- Sheet
- of
- File: